# Altium schematic sheet lowpass-filters.SchDoc
size A3; SheetNumber: 1; SheetTotal: 6
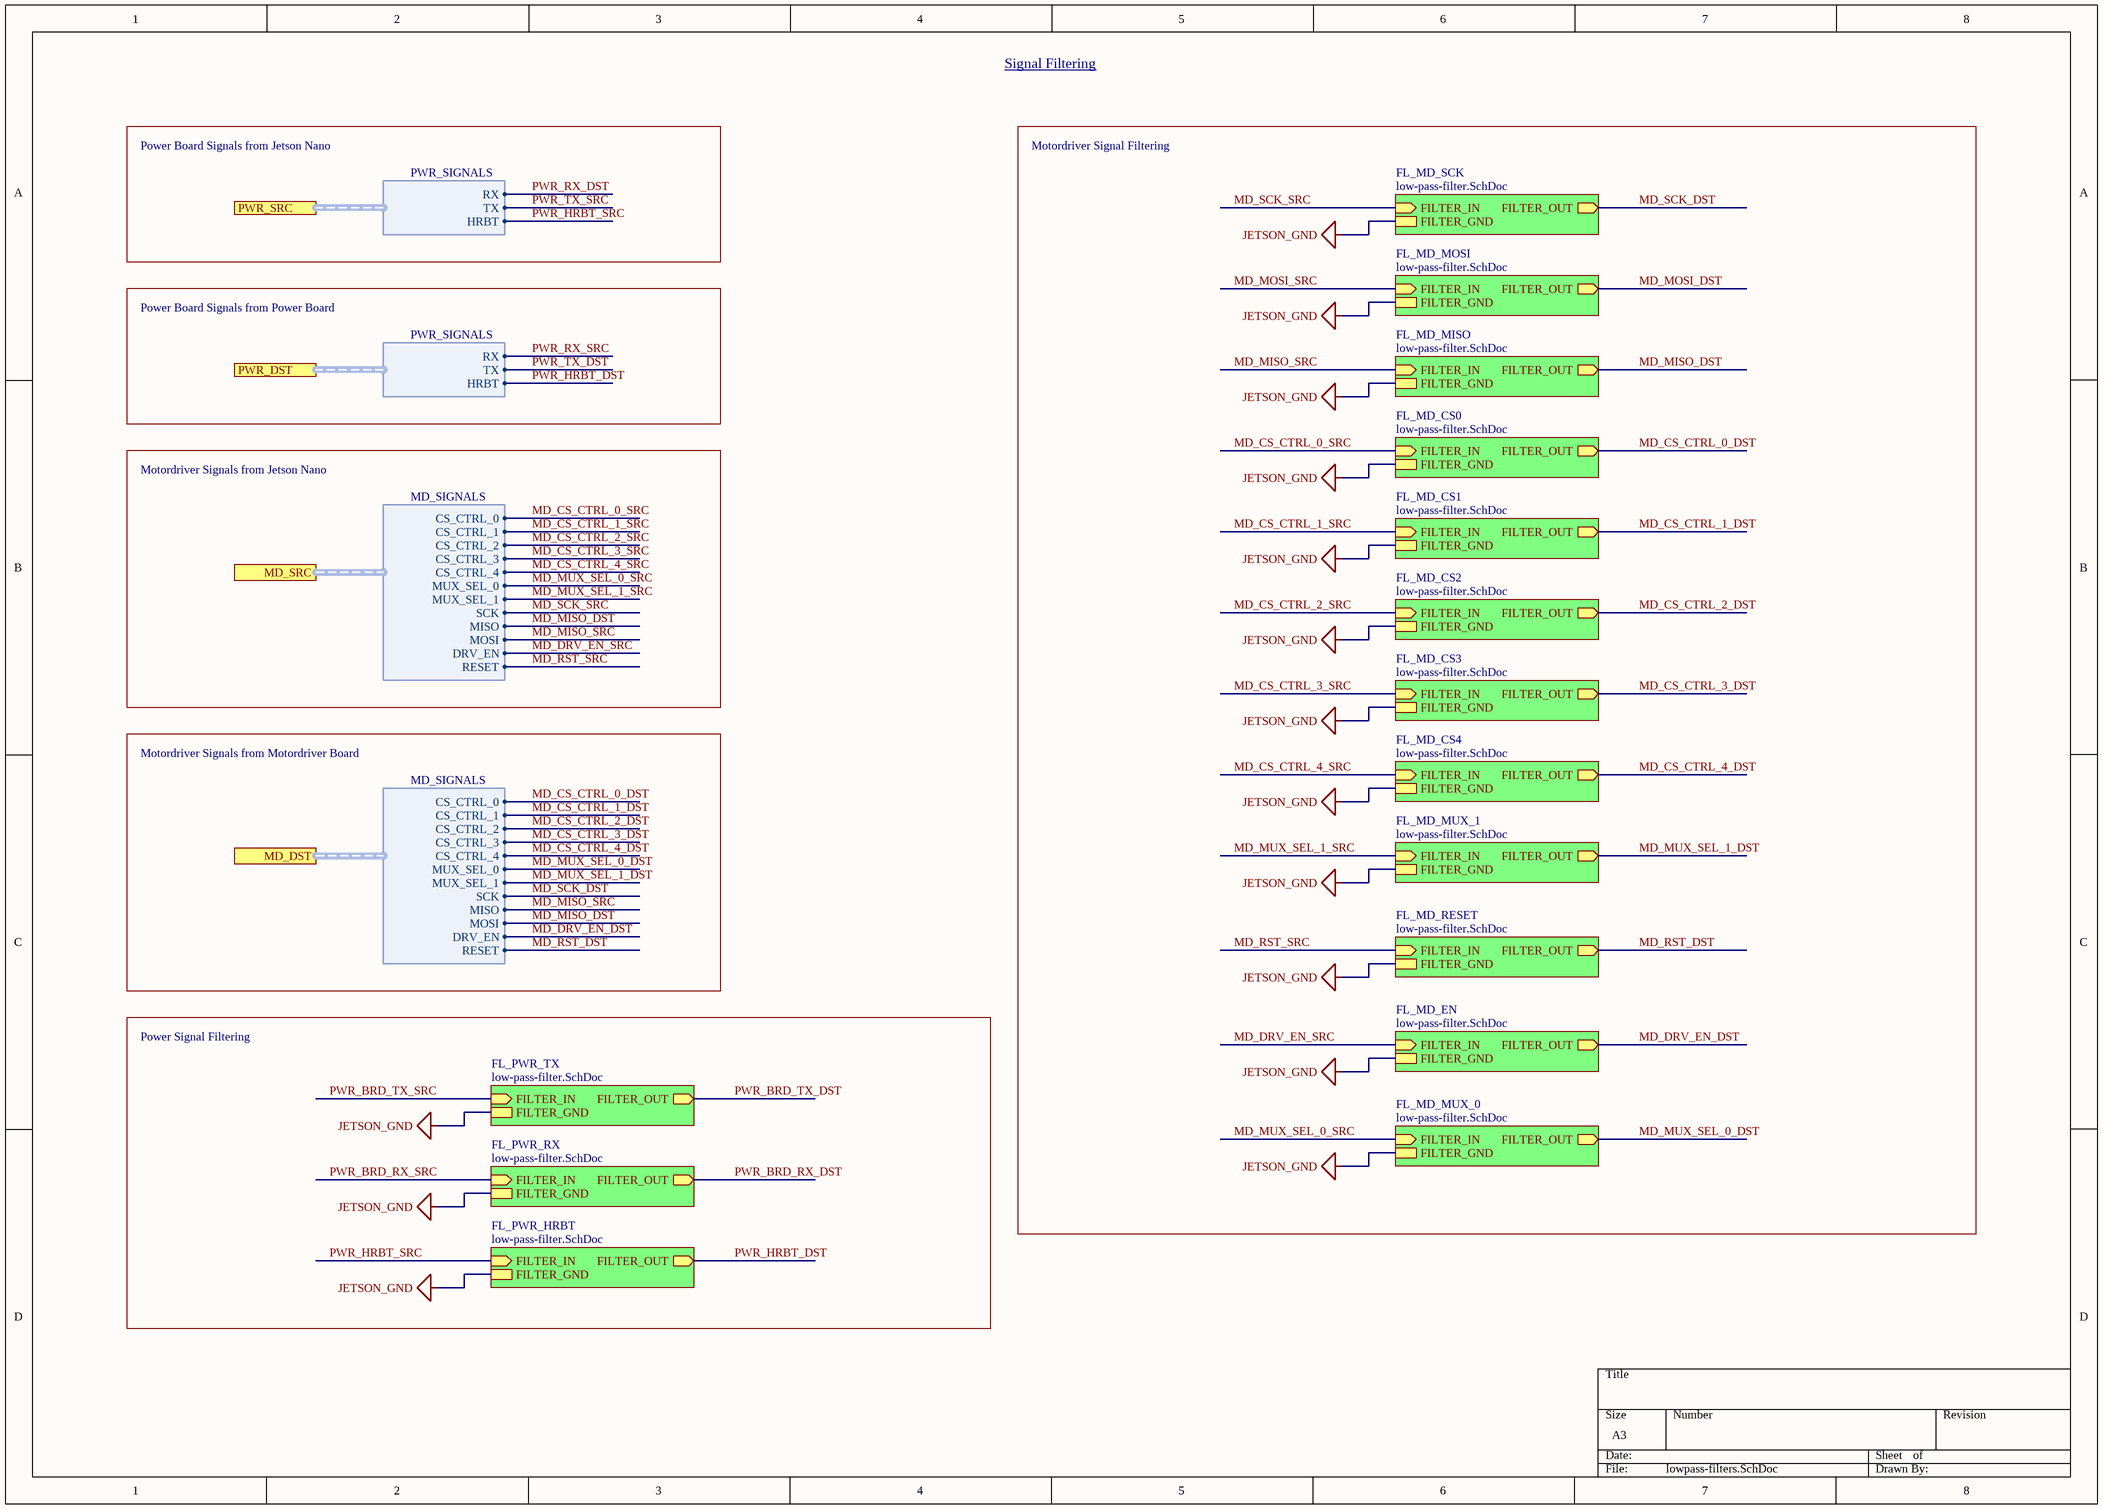
[diagram p0: lowpass-filters.SchDoc]

## Sub-sheets
FL_MD_CS0 = low-pass-filter.SchDoc: FILTER_OUT (out), FILTER_IN (in), FILTER_GND
FL_MD_CS1 = low-pass-filter.SchDoc: FILTER_OUT (out), FILTER_IN (in), FILTER_GND
FL_MD_CS2 = low-pass-filter.SchDoc: FILTER_OUT (out), FILTER_IN (in), FILTER_GND
FL_MD_CS3 = low-pass-filter.SchDoc: FILTER_OUT (out), FILTER_IN (in), FILTER_GND
FL_MD_CS4 = low-pass-filter.SchDoc: FILTER_OUT (out), FILTER_IN (in), FILTER_GND
FL_MD_EN = low-pass-filter.SchDoc: FILTER_OUT (out), FILTER_IN (in), FILTER_GND
FL_MD_MISO = low-pass-filter.SchDoc: FILTER_IN (in), FILTER_OUT (out), FILTER_GND
FL_MD_MOSI = low-pass-filter.SchDoc: FILTER_OUT (out), FILTER_IN (in), FILTER_GND
FL_MD_MUX_0 = low-pass-filter.SchDoc: FILTER_OUT (out), FILTER_IN (in), FILTER_GND
FL_MD_MUX_1 = low-pass-filter.SchDoc: FILTER_OUT (out), FILTER_IN (in), FILTER_GND
FL_MD_RESET = low-pass-filter.SchDoc: FILTER_OUT (out), FILTER_IN (in), FILTER_GND
FL_MD_SCK = low-pass-filter.SchDoc: FILTER_OUT (out), FILTER_IN (in), FILTER_GND
FL_PWR_HRBT = low-pass-filter.SchDoc: FILTER_IN (in), FILTER_OUT (out), FILTER_GND
FL_PWR_RX = low-pass-filter.SchDoc: FILTER_OUT (out), FILTER_IN (in), FILTER_GND
FL_PWR_TX = low-pass-filter.SchDoc: FILTER_OUT (out), FILTER_IN (in), FILTER_GND

## Ports
MD_DST (harness MD_SIGNALS), MD_SRC (harness MD_SIGNALS), PWR_DST (harness PWR_SIGNALS), PWR_SRC (harness PWR_SIGNALS)

## Harnesses
PWR_SIGNALS: TX, RX, HRBT
MD_SIGNALS: CS_CTRL_0, MUX_SEL_1, SCK, MOSI, MISO, CS_CTRL_1, CS_CTRL_2, CS_CTRL_3, CS_CTRL_4, MUX_SEL_0, DRV_EN, RESET

## Nets
JETSON_GND: sheet FL_MD_MUX_1/FILTER_GND, sheet FL_MD_SCK/FILTER_GND, sheet FL_MD_MOSI/FILTER_GND, sheet FL_MD_MISO/FILTER_GND, sheet FL_MD_CS0/FILTER_GND, sheet FL_MD_CS1/FILTER_GND, sheet FL_MD_CS2/FILTER_GND, sheet FL_MD_CS3/FILTER_GND, sheet FL_MD_CS4/FILTER_GND, sheet FL_MD_RESET/FILTER_GND, sheet FL_MD_EN/FILTER_GND, sheet FL_MD_MUX_0/FILTER_GND, sheet FL_PWR_TX/FILTER_GND, sheet FL_PWR_RX/FILTER_GND, sheet FL_PWR_HRBT/FILTER_GND
MD_CS_CTRL_0_DST: sheet FL_MD_CS0/FILTER_OUT, port MD_DST.CS_CTRL_0
MD_CS_CTRL_0_SRC: sheet FL_MD_CS0/FILTER_IN, port MD_SRC.CS_CTRL_0
MD_CS_CTRL_1_DST: sheet FL_MD_CS1/FILTER_OUT, port MD_DST.CS_CTRL_1
MD_CS_CTRL_1_SRC: sheet FL_MD_CS1/FILTER_IN, port MD_SRC.CS_CTRL_1
MD_CS_CTRL_2_DST: sheet FL_MD_CS2/FILTER_OUT, port MD_DST.CS_CTRL_2
MD_CS_CTRL_2_SRC: sheet FL_MD_CS2/FILTER_IN, port MD_SRC.CS_CTRL_2
MD_CS_CTRL_3_DST: sheet FL_MD_CS3/FILTER_OUT, port MD_DST.CS_CTRL_3
MD_CS_CTRL_3_SRC: sheet FL_MD_CS3/FILTER_IN, port MD_SRC.CS_CTRL_3
MD_CS_CTRL_4_DST: sheet FL_MD_CS4/FILTER_OUT, port MD_DST.CS_CTRL_4
MD_CS_CTRL_4_SRC: sheet FL_MD_CS4/FILTER_IN, port MD_SRC.CS_CTRL_4
MD_DRV_EN_DST: sheet FL_MD_EN/FILTER_OUT, port MD_DST.DRV_EN
MD_DRV_EN_SRC: sheet FL_MD_EN/FILTER_IN, port MD_SRC.DRV_EN
MD_MISO_DST: sheet FL_MD_MISO/FILTER_OUT, port MD_SRC.MISO, port MD_DST.MOSI
MD_MISO_SRC: sheet FL_MD_MISO/FILTER_IN, port MD_SRC.MOSI, port MD_DST.MISO
MD_MOSI_DST: sheet FL_MD_MOSI/FILTER_OUT
MD_MOSI_SRC: sheet FL_MD_MOSI/FILTER_IN
MD_MUX_SEL_0_DST: sheet FL_MD_MUX_0/FILTER_OUT, port MD_DST.MUX_SEL_0
MD_MUX_SEL_0_SRC: sheet FL_MD_MUX_0/FILTER_IN, port MD_SRC.MUX_SEL_0
MD_MUX_SEL_1_DST: sheet FL_MD_MUX_1/FILTER_OUT, port MD_DST.MUX_SEL_1
MD_MUX_SEL_1_SRC: sheet FL_MD_MUX_1/FILTER_IN, port MD_SRC.MUX_SEL_1
MD_RST_DST: sheet FL_MD_RESET/FILTER_OUT, port MD_DST.RESET
MD_RST_SRC: sheet FL_MD_RESET/FILTER_IN, port MD_SRC.RESET
MD_SCK_DST: sheet FL_MD_SCK/FILTER_OUT, port MD_DST.SCK
MD_SCK_SRC: sheet FL_MD_SCK/FILTER_IN, port MD_SRC.SCK
PWR_BRD_RX_DST: sheet FL_PWR_RX/FILTER_OUT
PWR_BRD_RX_SRC: sheet FL_PWR_RX/FILTER_IN
PWR_BRD_TX_DST: sheet FL_PWR_TX/FILTER_OUT
PWR_BRD_TX_SRC: sheet FL_PWR_TX/FILTER_IN
PWR_HRBT_DST: sheet FL_PWR_HRBT/FILTER_OUT, port PWR_DST.HRBT
PWR_HRBT_SRC: sheet FL_PWR_HRBT/FILTER_IN, port PWR_SRC.HRBT
PWR_RX_DST: port PWR_SRC.RX
PWR_RX_SRC: port PWR_DST.RX
PWR_TX_DST: port PWR_DST.TX
PWR_TX_SRC: port PWR_SRC.TX

## Notes on the sheet
- Signal Filtering
- Power Board Signals from Jetson Nano
- Motordriver Signal Filtering
- Power Board Signals from Power Board
- Motordriver Signals from Jetson Nano
- Motordriver Signals from Motordriver Board
- Power Signal Filtering